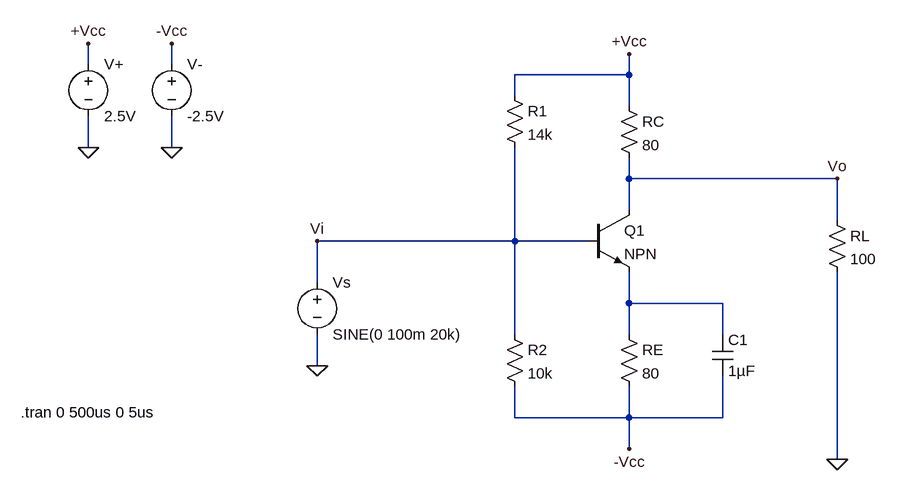
[diagram p0: schematic a-amp.asc]
a-amp.asc, the LTspice schematic file:
Version 4
SHEET 1 880 680
WIRE -400 -96 -400 -128
WIRE -272 -96 -272 -128
WIRE 432 -80 432 -112
WIRE 432 -80 256 -80
WIRE 256 -48 256 -80
WIRE 432 -32 432 -80
WIRE -400 32 -400 -16
WIRE -272 32 -272 -16
WIRE 432 80 432 48
WIRE 752 80 432 80
WIRE 432 128 432 80
WIRE 752 144 752 80
WIRE 256 176 256 32
WIRE 256 176 -48 176
WIRE 368 176 256 176
WIRE -48 240 -48 176
WIRE 432 272 432 224
WIRE 576 272 432 272
WIRE 256 320 256 176
WIRE 432 320 432 272
WIRE 576 320 576 272
WIRE -48 368 -48 320
WIRE 256 448 256 400
WIRE 432 448 432 400
WIRE 432 448 256 448
WIRE 576 448 576 384
WIRE 576 448 432 448
WIRE 432 496 432 448
WIRE 752 512 752 224
FLAG -400 32 0
FLAG -272 32 0
FLAG -48 368 0
FLAG -400 -128 +Vcc
FLAG -272 -128 -Vcc
FLAG 432 -112 +Vcc
FLAG 432 496 -Vcc
FLAG -48 176 Vi
FLAG 752 512 0
FLAG 752 80 Vo
SYMBOL npn 368 128 R0
SYMATTR InstName Q1
SYMBOL res 416 -48 R0
SYMATTR InstName RC
SYMATTR Value 80
SYMBOL res 416 304 R0
SYMATTR InstName RE
SYMATTR Value 80
SYMBOL cap 560 320 R0
SYMATTR InstName C1
SYMATTR Value 1µF
SYMBOL voltage -48 224 R0
WINDOW 123 0 0 Left 0
WINDOW 39 0 0 Left 0
SYMATTR InstName Vs
SYMATTR Value SINE(0 100m 20k)
SYMBOL voltage -400 -112 R0
SYMATTR InstName V+
SYMATTR Value 2.5V
SYMBOL voltage -272 -112 R0
SYMATTR InstName V-
SYMATTR Value -2.5V
SYMBOL res 240 -64 R0
SYMATTR InstName R1
SYMATTR Value 14k
SYMBOL res 240 304 R0
SYMATTR InstName R2
SYMATTR Value 10k
SYMBOL res 736 128 R0
SYMATTR InstName RL
SYMATTR Value 100
TEXT -504 440 Left 2 !.tran 0 500us 0 5us

The netlist it stands for:
* a-amp.asc
Q1 Vo Vi N001 0 NPN
RC +Vcc Vo 80
RE N001 -Vcc 80
C1 N001 -Vcc 1µF
Vs Vi 0 SINE(0 100m 20k)
V+ +Vcc 0 2.5V
V- -Vcc 0 -2.5V
R1 +Vcc Vi 14k
R2 Vi -Vcc 10k
RL Vo 0 100
.model NPN NPN
.model PNP PNP
.lib standard.bjt
.tran 0 500us 0 5us
.backanno
.end